# EAGLE schematic uC_Main 2 (EAGLE 8.5.0)
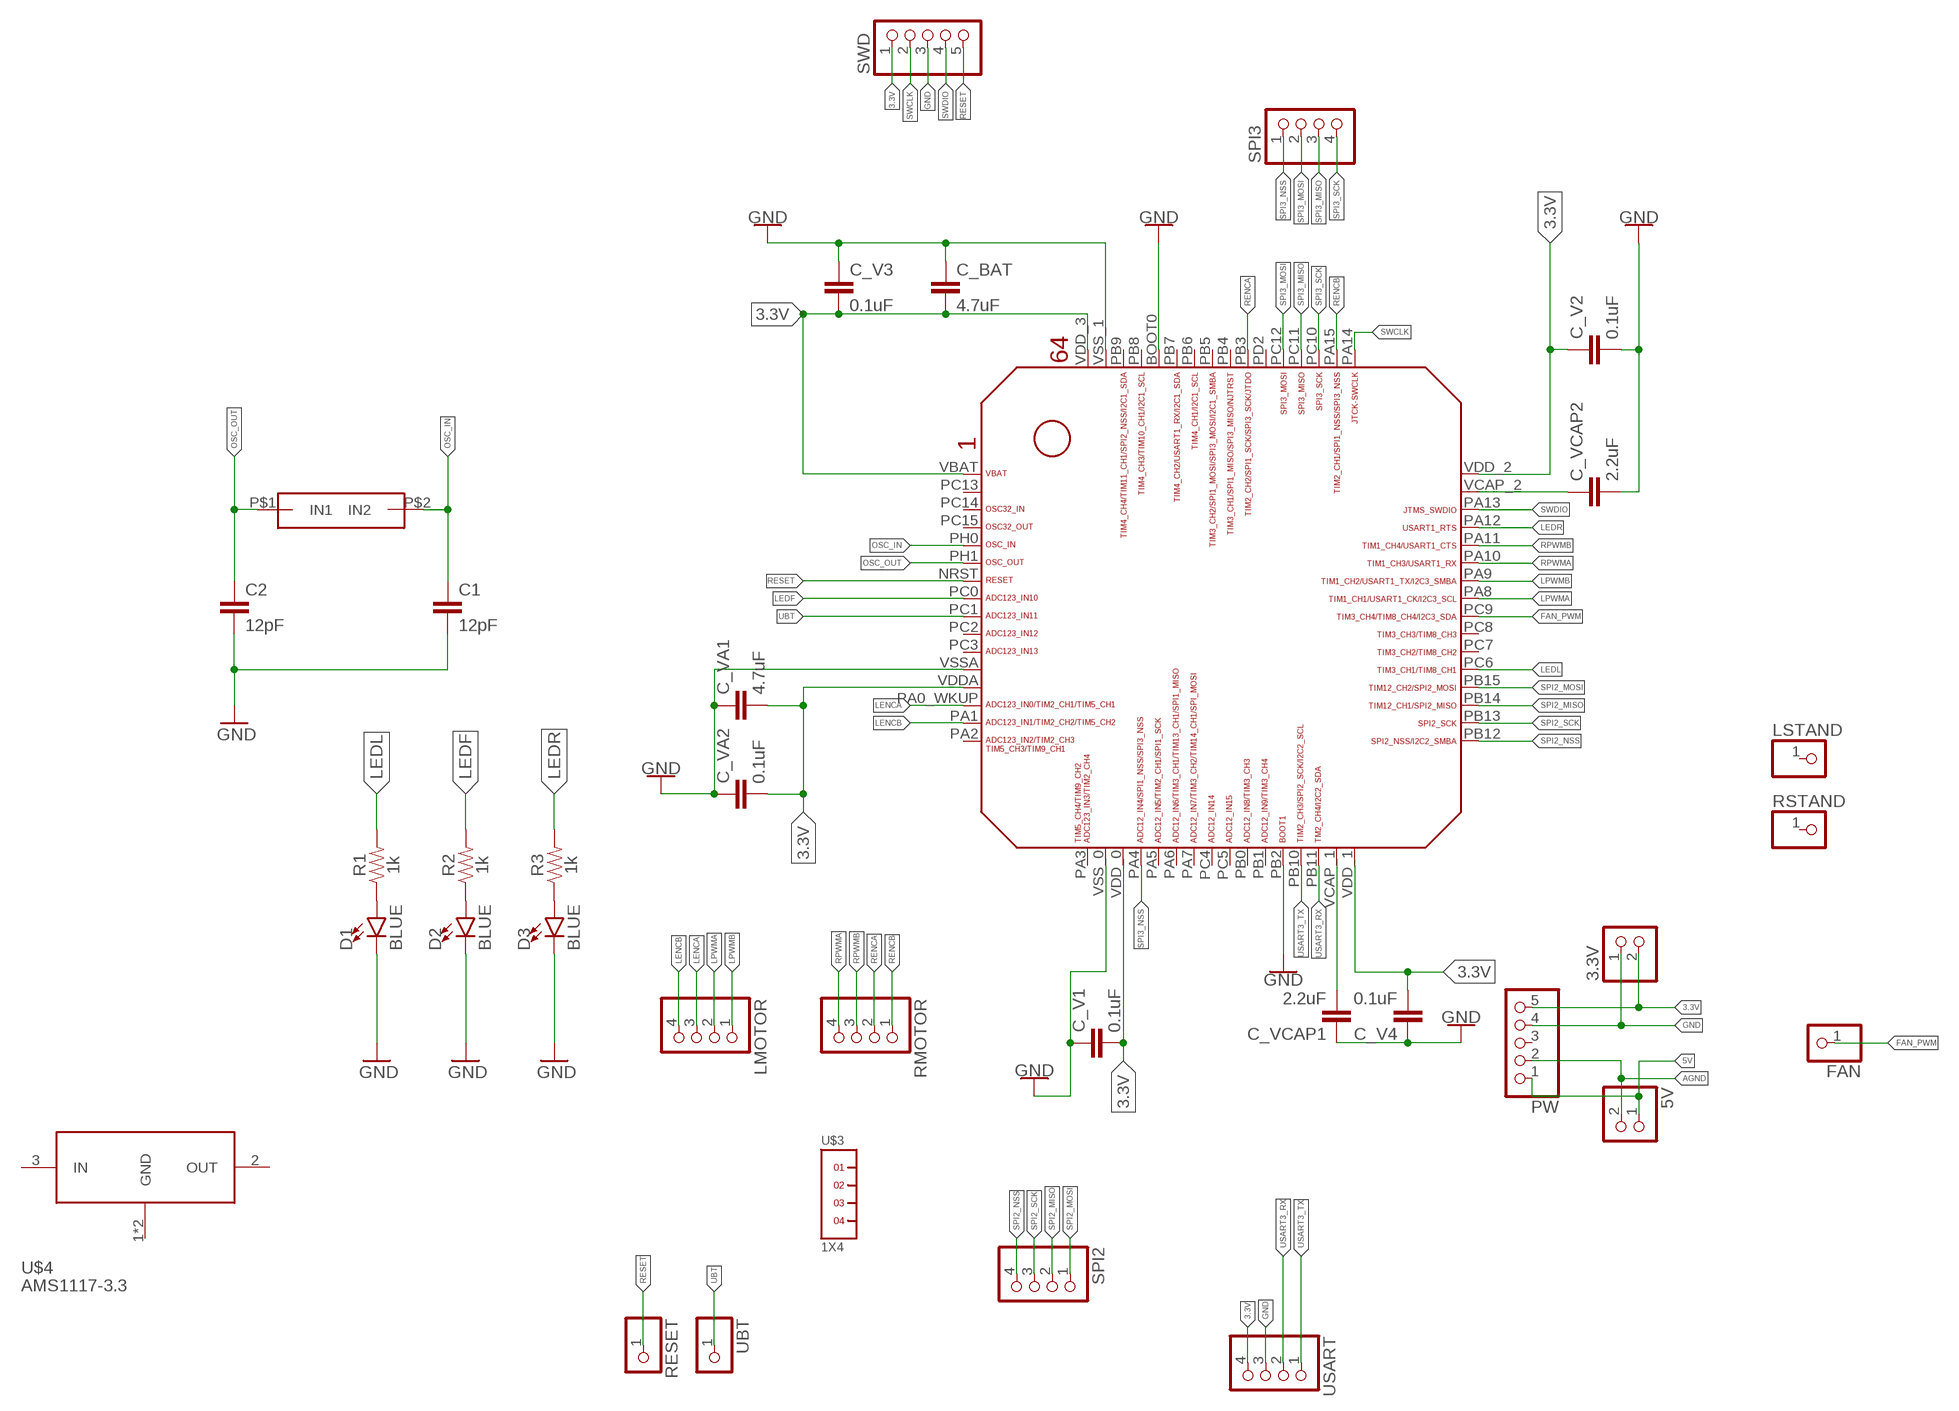
[diagram p0: schematic, sheet 1]

## Parts
3.3V  PINHD-1X2  [1X02]
5V  PINHD-1X2  [1X02]
C1  12pF  22PF-0603-50V-5%  [0603]
C2  12pF  22PF-0603-50V-5%  [0603]
C_BAT  4.7uF  22UF-0805-6.3V-20%  [0805]
C_V1  0.1uF  22UF-0805-6.3V-20%  [0805]
C_V2  0.1uF  22UF-0805-6.3V-20%  [0805]
C_V3  0.1uF  22UF-0805-6.3V-20%  [0805]
C_V4  0.1uF  22UF-0805-6.3V-20%  [0805]
C_VA1  4.7uF  22UF-0805-6.3V-20%  [0805]
C_VA2  0.1uF  22UF-0805-6.3V-20%  [0805]
C_VCAP1  2.2uF  22UF-0805-6.3V-20%  [0805]
C_VCAP2  2.2uF  22UF-0805-6.3V-20%  [0805]
D1  BLUE  LED-BLUE1206  [LED-1206]
D2  BLUE  LED-BLUE1206  [LED-1206]
D3  BLUE  LED-BLUE1206  [LED-1206]
FAN  PINHD-1X1  [1X01]
LMOTOR  PINHD-1X4  [1X04]
LSTAND  PINHD-1X1  [1X01]
PW  PINHD-1X5  [1X05]
R1  1k  0.75OHM-0805-1/4W-1%  [0805]
R2  1k  0.75OHM-0805-1/4W-1%  [0805]
R3  1k  0.75OHM-0805-1/4W-1%  [0805]
RESET  PINHD-1X1  [1X01]
RMOTOR  PINHD-1X4  [1X04]
RSTAND  PINHD-1X1  [1X01]
SPI2  PINHD-1X4  [1X04]
SPI3  PINHD-1X4  [1X04]
SWD  PINHD-1X5  [1X05]
U$1  STM32F405/415_LQFP64  [STM32F405/415_LQFP64]
U$2  OSC  [OSC]
U$3  1X4  [1X4]
U$4  AMS1117-3.3  [SOT-223]
UBT  PINHD-1X1  [1X01]
USART  PINHD-1X4  [1X04]

## Nets
3.3V: 3.3V.2 C_BAT.2 C_V1.2 C_V2.1 C_V3.2 C_V4.2 C_VA1.2 C_VA2.2 PW.5 SWD.1 U$1.VBAT U$1.VDD_0 U$1.VDD_1 U$1.VDD_2 U$1.VDD_3 U$1.VDDA USART.4
5V: 5V.1 PW.1
AGND: 5V.2 PW.2
FAN_PWM: FAN.1 U$1.PC9
GND: 3.3V.1 C1.2 C2.2 C_BAT.1 C_V1.1 C_V2.2 C_V3.1 C_V4.1 C_VA1.1 C_VA2.1 C_VCAP1.1 C_VCAP2.2 D1.C D2.C D3.C PW.4 SWD.3 U$1.BOOT0 U$1.PB2 U$1.VSS_0 U$1.VSS_1 U$1.VSSA USART.3
LEDF: R2.2 U$1.PC0
LEDL: R1.2 U$1.PC6
LEDR: R3.2 U$1.PA12
LENCA: LMOTOR.3 U$1.PA0_WKUP(PA0_AKUP)
LENCB: LMOTOR.4 U$1.PA1
LPWMA: LMOTOR.2 U$1.PA8
LPWMB: LMOTOR.1 U$1.PA9
N$1: D1.A R1.1
N$2: D2.A R2.1
N$3: D3.A R3.1
OSC_IN: C1.1 U$1.PH0 U$2.P$2(IN2)
OSC_OUT: C2.1 U$1.PH1 U$2.P$1(IN1)
RENCA: RMOTOR.2 U$1.PB3
RENCB: RMOTOR.1 U$1.PA15
RESET: RESET.1 SWD.5 U$1.NRST
RPWMA: RMOTOR.4 U$1.PA10
RPWMB: RMOTOR.3 U$1.PA11
SPI2_MISO: SPI2.2 U$1.PB14
SPI2_MOSI: SPI2.1 U$1.PB15
SPI2_NSS: SPI2.4 U$1.PB12
SPI2_SCK: SPI2.3 U$1.PB13
SPI3_MISO: SPI3.3 U$1.PC11
SPI3_MOSI: SPI3.2 U$1.PC12
SPI3_NSS: SPI3.1 U$1.PA4
SPI3_SCK: SPI3.4 U$1.PC10
SWCLK: SWD.2 U$1.PA14
SWDIO: SWD.4 U$1.PA13
UBT: U$1.PC1 UBT.1
USART3_RX: U$1.PB11 USART.2
USART3_TX: U$1.PB10 USART.1
VCAP_1: C_VCAP1.2 U$1.VCAP_1
VCAP_2: C_VCAP2.1 U$1.VCAP_2
Unconnected: LSTAND.1 PW.3 RSTAND.1 U$1.PA2 U$1.PA3 U$1.PA5 U$1.PA6 U$1.PA7 U$1.PB0 U$1.PB1 U$1.PB4 U$1.PB5 U$1.PB6 U$1.PB7 U$1.PB8 U$1.PB9 U$1.PC2 U$1.PC3 U$1.PC4 U$1.PC5 U$1.PC7 U$1.PC8 U$1.PC13 U$1.PC14 U$1.PC15 U$1.PD2 U$3.1 U$3.2 U$3.3 U$3.4 U$4.1(GND) U$4.2(OUT) U$4.3(IN) U$4.4(GND)

## Library data of the parts
3.3V 5V = pinhead:PINHD-1X2: PIN HEADER
C1 C2 = SparkFun-Capacitors:22PF: 22pF ceramic capacitors A capacitor is a passive two-terminal electrical component used to store electrical energy temporarily in an electric field.; PROD_ID: CAP-07876; VALUE: 22pF
C_BAT C_V1-C_V4 C_VA1 C_VA2 C_VCAP1 C_VCAP2 = SparkFun-Capacitors:22UF: 22µF ceramic capacitors A capacitor is a passive two-terminal electrical component used to store electrical energy temporarily in an electric field.; PROD_ID: CAP-08402; VALUE: 22uF
D1-D3 = SparkFun-LED:LED-BLUE: Blue SMD LED Used in manufacturing of various products at SparkFun Packages: 0603 - SMD 0603 package [Product Link] <http://www.digikey.com/product-detail/en/SMLE12BC7TT86/511-1589-2-ND/1641808> 1206 - SMD1206 package [Product Link] <http://www.digikey.com/product-detail/en/lite-on-inc/LTST-C150TBKT/160-1643-1-ND/573584> SparkFun Products: ESP8266 Thing-Dev Board <https://www.sparkfun.com/products/13711> RedBoard <https://www.sparkfun.com/products/12757>; PROD_ID: DIO-09911
FAN LSTAND RESET RSTAND UBT = pinhead:PINHD-1X1: PIN HEADER
LMOTOR RMOTOR SPI2 SPI3 USART = pinhead:PINHD-1X4: PIN HEADER
PW SWD = pinhead:PINHD-1X5: PIN HEADER
R1-R3 = SparkFun-Resistors:0.75OHM: 0.75Ω resistor A resistor is a passive two-terminal electrical component that implements electrical resistance as a circuit element. Resistors act to reduce current flow, and, at the same time, act to lower voltage levels within circuits. - Wikipedia; PROD_ID: RES-08474; VALUE: 0.75
U$1 = STM32F405RG:STM32F405/415_LQFP64
U$2 = Cristal Oscillator:OSC
U$3 = headers(2mm):1X4
U$4 = AMS1117-3.3:AMS1117-3.3: 1A LOW DROPOUT VOLTAGE REGULATOR; AVAILABILITY: Unavailable; DESCRIPTION: Sot223/Pkg 1-Amp 3.3-Volt Low Drop Out Voltage Regulatator; MF: Advanced Monolithic Systems; MP: AMS1117-3.3; PACKAGE: None; PRICE: None